# EAGLE schematic car (EAGLE 7.2.0)
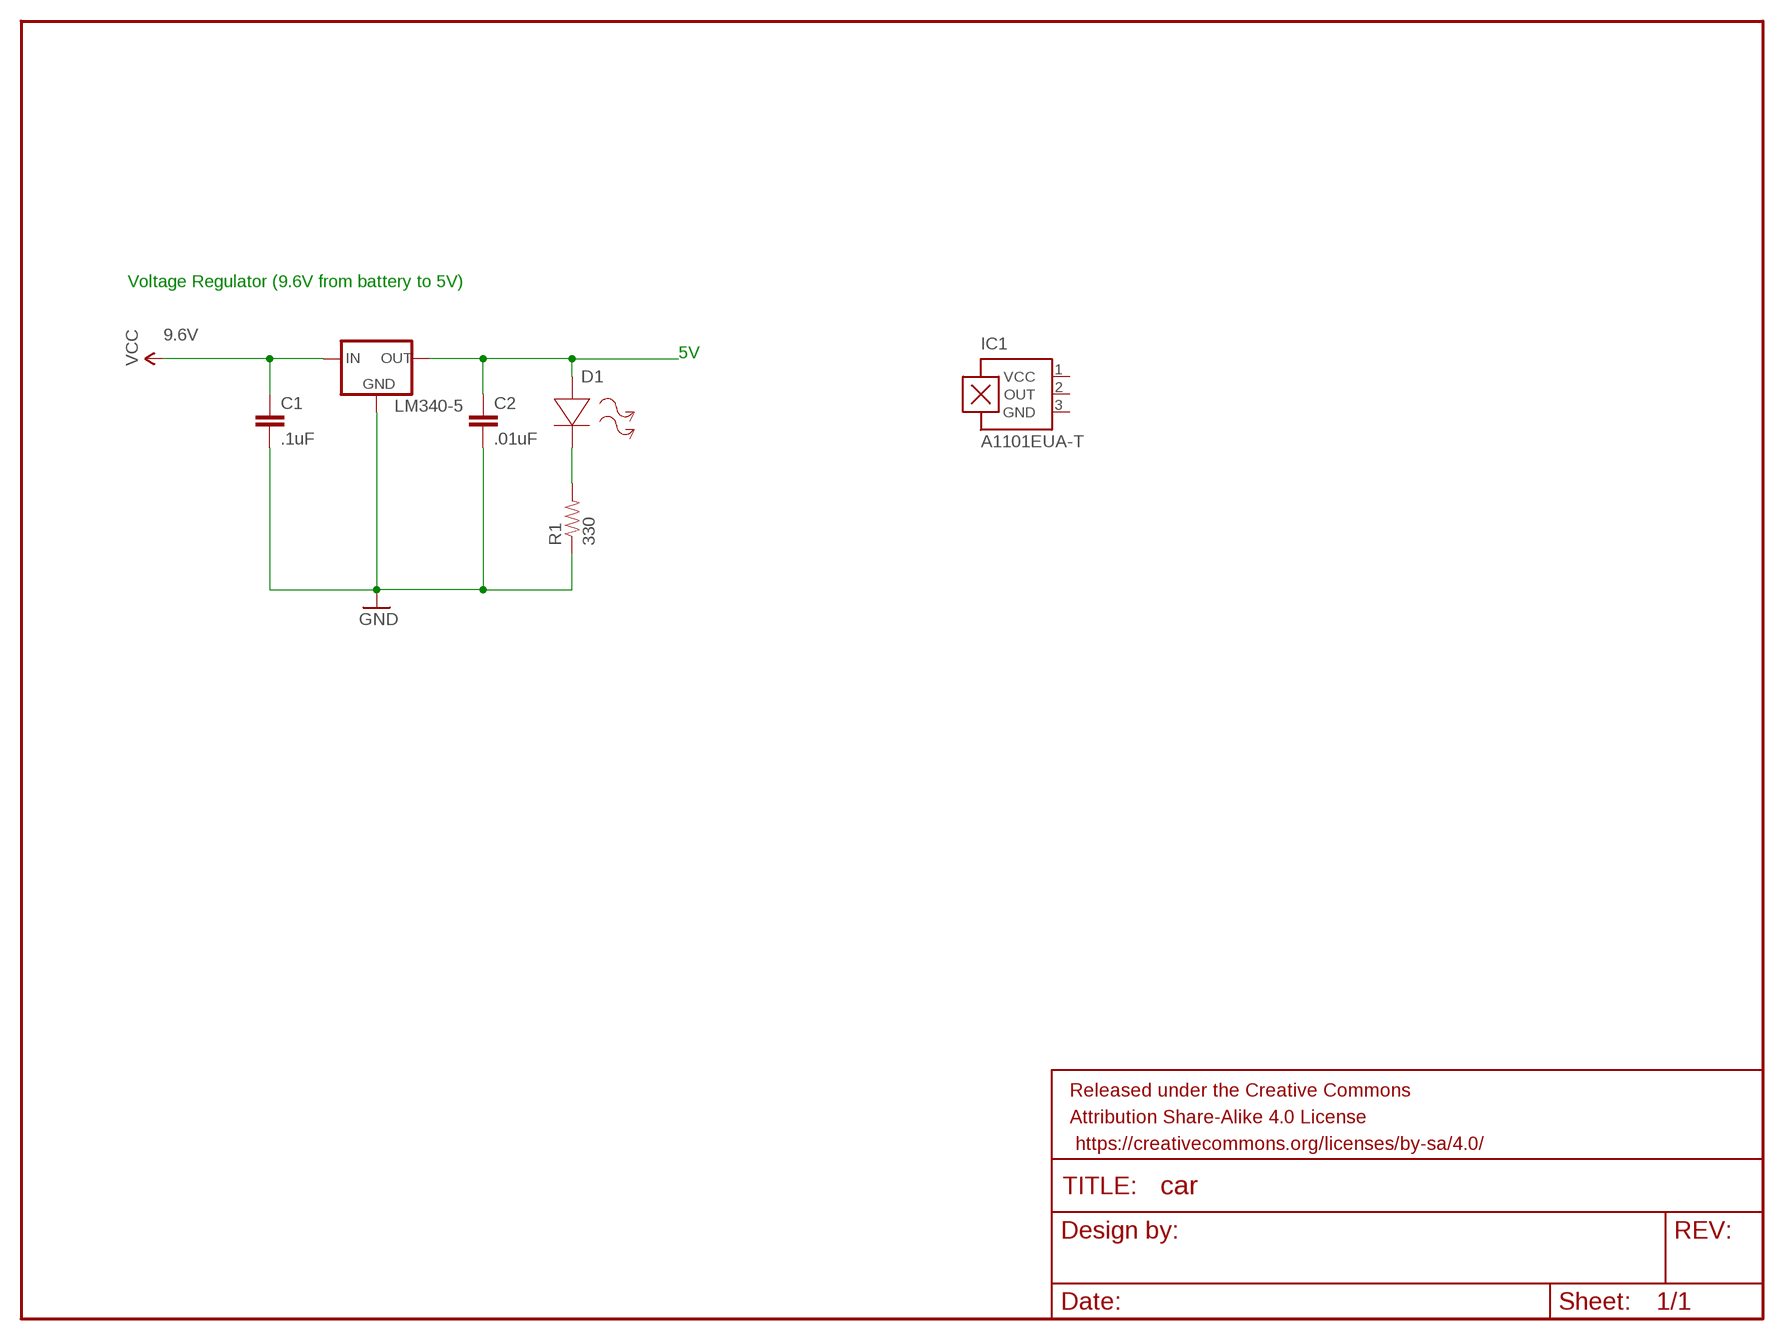
[diagram p0: schematic, sheet 1]

## Parts
C1  .1uF  CAP0402-CAP  [0402-CAP]
C2  .01uF  CAP0402-CAP  [0402-CAP]
D1  LED  [R0805]
FRAME1  FRAME-LETTER  [CREATIVE_COMMONS]
IC1  A1101EUA-T  A1301LH  [SOT23-W]
LM340-5  V_REG_78XX-TO-220  [TO-220-ALT]
R1  330  RESISTOR0402-RES  [0402-RES]

## Nets
GND: C1.2 C2.2 LM340-5.GND R1.1
N$2: D1.2(-) R1.2
N$4: C2.1 D1.1(+) LM340-5.OUT
VCC: C1.1 LM340-5.IN
Unconnected: IC1.2(OUT)

## Notes on the sheet
- Voltage Regulator (9.6V from battery to 5V)
- 5V

## Power pins joined to a net without a drawn wire
GND: IC1.3(GND)
VCC: IC1.1(VCC)

## Library data of the parts
C1 C2 = SparkFun-Capacitors:CAP: Capacitor Standard 0603 ceramic capacitor, and 0.1" leaded capacitor.
D1 = sym:LED: Light Emitting Diode; SPICEMODEL: NONE; SPICETYPE: diode
FRAME1 = SparkFun-Aesthetics:FRAME-LETTER: Schematic Frame Standard 8.5x11 US Letter frame; DESIGNER: NAME; VERSION: v01
IC1 = allegro:A13*?: Linear Hall Effect Sensor ICs Continuous-Time Ratiometric High-Temperature Operation Programmable Linear with Analog Output A1302 -Replacement- UGN3503 Source: http://www.allegromicro.com/en/Products/Part_Numbers/1301/1301.pdf http://www.allegromicro.com/en/Products/Part_Numbers/1321/1321.pdf http://www.allegromicro.com/en/Products/Part_Numbers/1381/1381.pdf; MF: ALLEGRO MICROSYSTEMS, INC.; MPN: A1301ELHLT-T; OC_FARNELL: 1198084; OC_NEWARK: 31K6634
LM340-5 = SparkFun-PowerIC:V_REG_78XX: Voltage Regulator Standard 78xx regulator. IGO (Input Ground Output). Spark Fun Electronics SKU : COM-00107; PROD_ID: VREG-08450; SF_ID: COM-00107
R1 = SparkFun-Passives:RESISTOR: Resistor Basic schematic elements and footprints for 0603, 1206, and PTH resistors.